# Altium project Stethoscope.PrjPcb
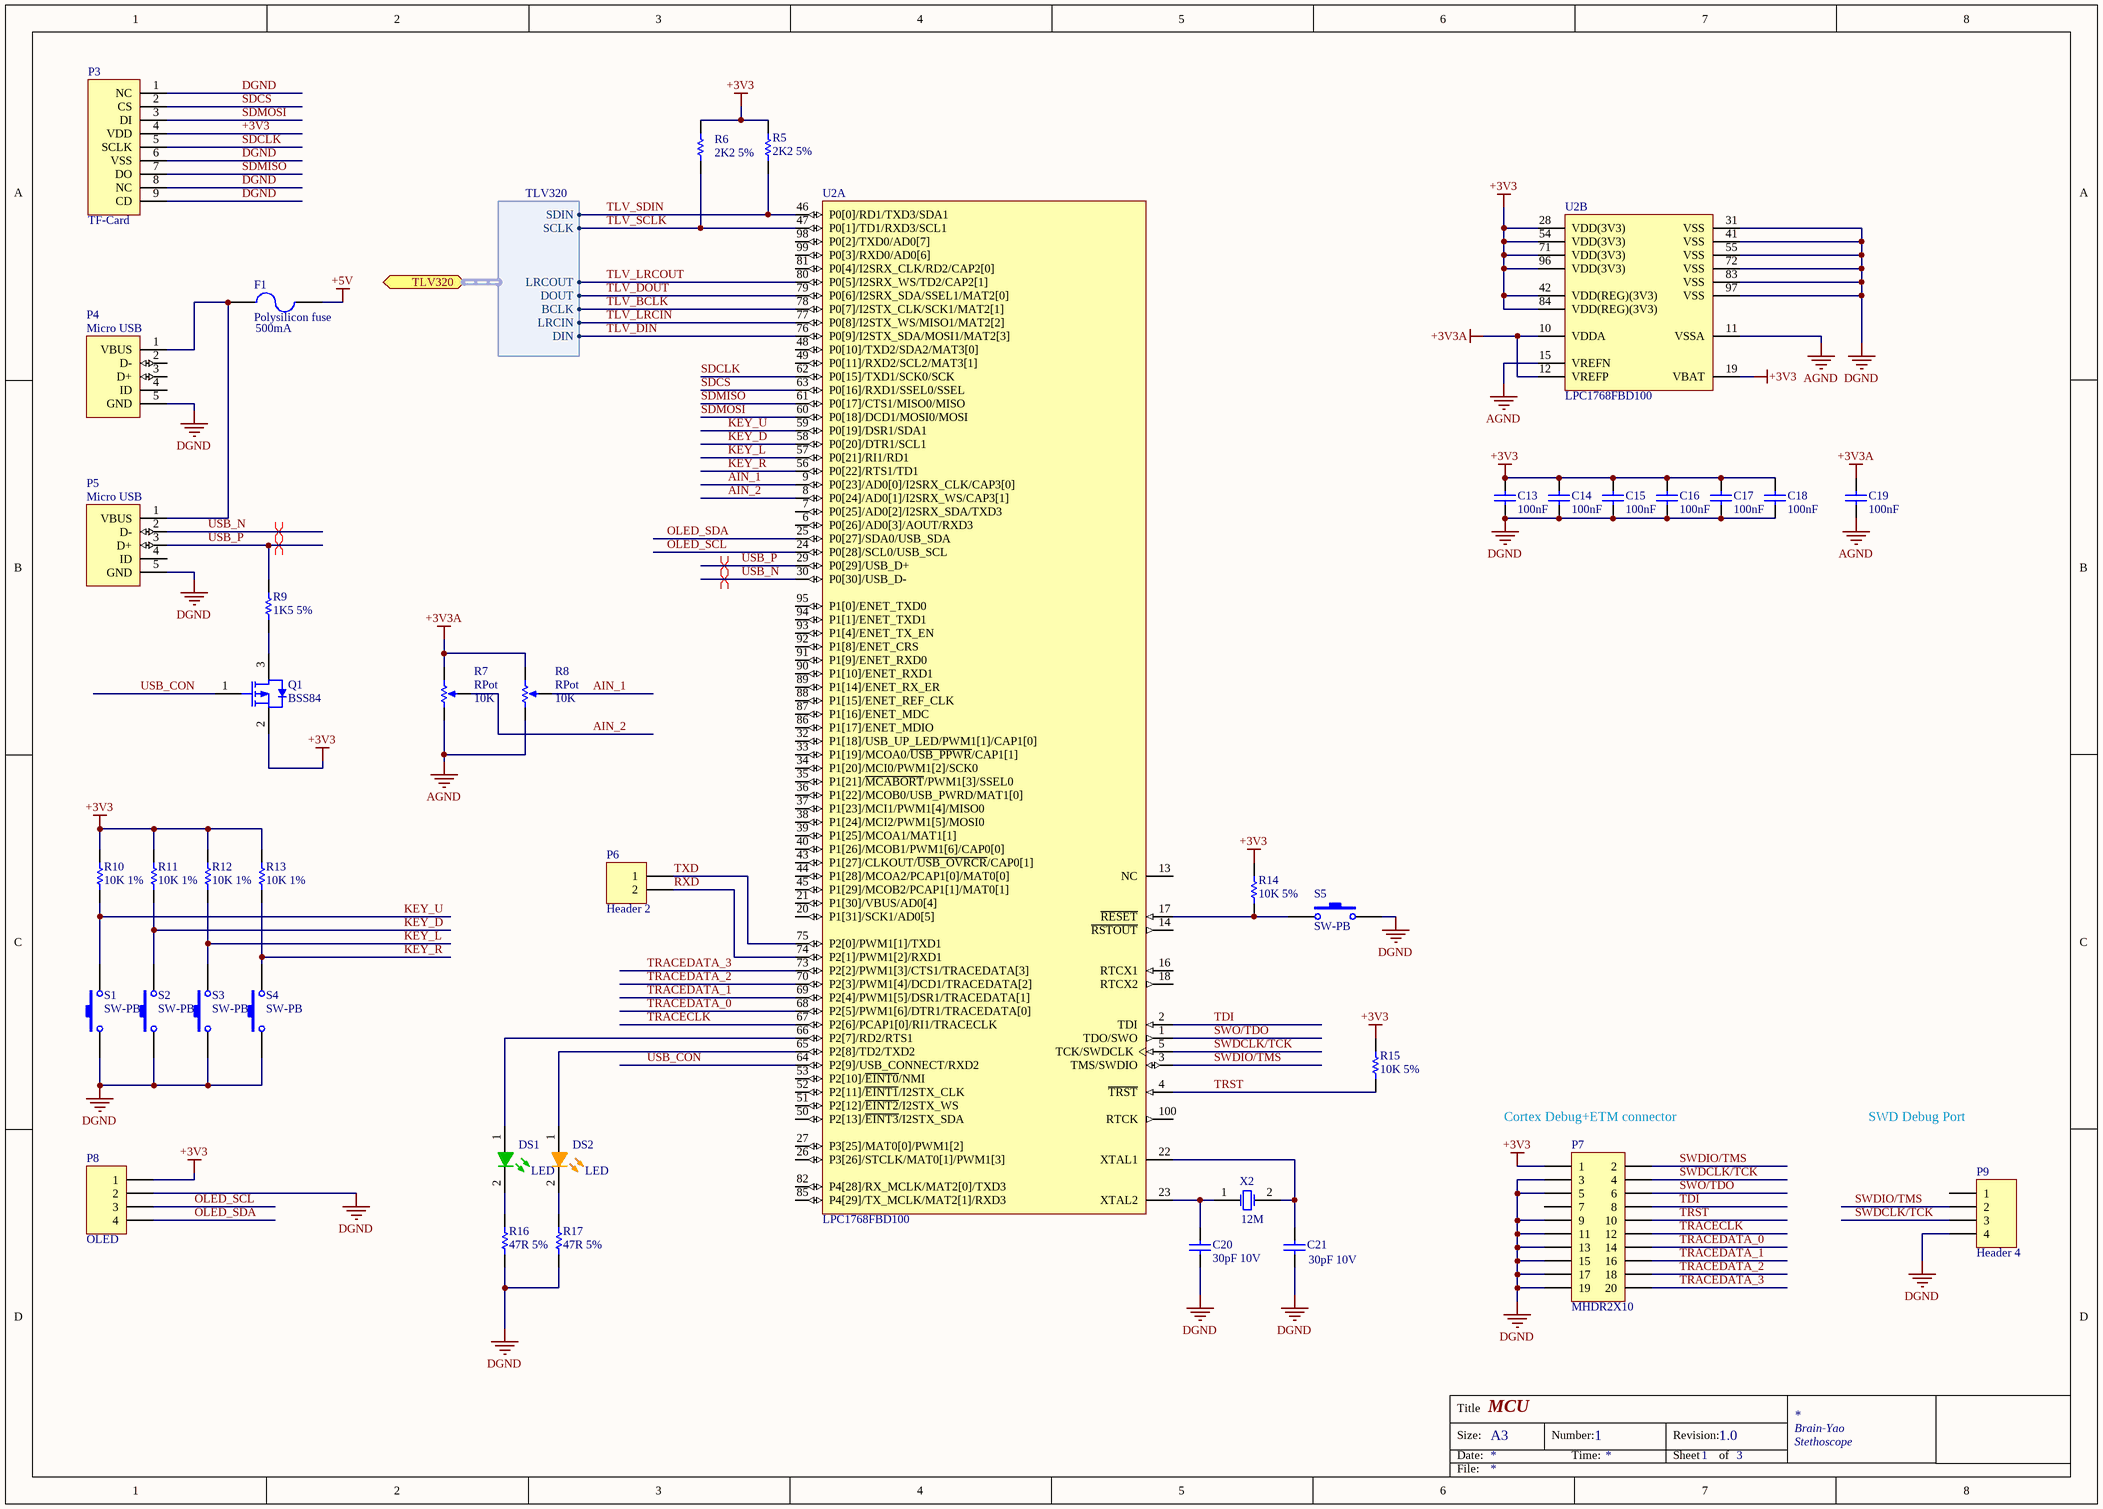
[diagram p0: MCU.SchDoc]
3 sheets, 75 parts. Net scope: flat (ports and power ports of the same name join across sheets).
Board file: Stethoscope.PcbDoc
Sheets:
  MCU.SchDoc
  Codec.SchDoc
  Power.SchDoc

## Sheet MCU.SchDoc: MCU
size A3; DrawnBy: Brain-Yao; DocumentNumber: 1; Revision: 1.0; SheetNumber: 1; SheetTotal: 3; ProjectName: Stethoscope

### Parts
(Parts that share a designator on the sheet are numbered #1, #2 ... from top to bottom, then left to right.)
C13  100nF  [CAPC0603(1608)100_M]
C14  100nF  [CAPC0603(1608)100_M]
C15  100nF  [CAPC0603(1608)100_M]
C16  100nF  [CAPC0603(1608)100_M]
C17  100nF  [CAPC0603(1608)100_M]
C18  100nF  [CAPC0603(1608)100_M]
C19  100nF  [CAPC0603(1608)100_M]
C20  30pF 10V  [CAPC0603(1608)100_M]
C21  30pF 10V  [CAPC0603(1608)100_M]
DS1  LED  [KING-0603LED_GREEN_V]
DS2  LED  [KING-0603LED_ORANGE_V]
F1  Polysilicon fuse  value 500mA  [RESC2012N]
P3  TF-Card  [Micro_TF_01A]
P4  Micro USB  [HIRO-ZX62D-AB-5P8_V]
P5  Micro USB  [HIRO-ZX62D-AB-5P8_V]
P6  Header 2  [HDR1X2]
P7  MHDR2X10  [MHDR2X10]
P8  OLED  [OLED]
P9  Header 4  [HDR1X4]
Q1  BSS84  [NXP-SOT23_N]
R5  2K2 5%  [RESC0603(1608)_M]
R6  2K2 5%  [RESC0603(1608)_M]
R7  RPot  value 10K  [R09]
R8  RPot  value 10K  [R09]
R9  1K5 5%  [RESC0603(1608)_M]
R10  10K 1%  [RESC0603(1608)_M]
R11  10K 1%  [RESC0603(1608)_M]
R12  10K 1%  [RESC0603(1608)_M]
R13  10K 1%  [RESC0603(1608)_M]
R14  10K 5%  [RESC0603(1608)_M]
R15  10K 5%  [RESC0603(1608)_M]
R16  47R 5%  [RESC0603(1608)_M]
R17  47R 5%  [RESC0603(1608)_M]
S1  SW-PB  [4x4_switch]
S2  SW-PB  [4x4_switch]
S3  SW-PB  [4x4_switch]
S4  SW-PB  [4x4_switch]
S5  SW-PB  [4x4_switch]
U2#1  LPC1768FBD100  [SOT407-1_L]  (part A of 2)
U2#2  LPC1768FBD100  [SOT407-1_L]  (part B of 2)
X2  12M  [49S]

### Ports
TLV320 (harness TLV320)

### Harnesses
TLV320: SDIN, SCLK, LRCOUT, DOUT, BCLK, DIN, LRCIN

### Nets
+3V3: C13.2 C14.2 C15.2 C16.2 C17.2 C18.2 P3.4(VDD) P7.1 P8.1 Q1.2(S) R5.2 R6.2 R10.2 R11.2 R12.2 R13.2 R14.2 R15.2 U2#2.19(VBAT) U2#2.28(VDD(3V3)) U2#2.42(VDD(REG)(3V3)) U2#2.54(VDD(3V3)) U2#2.71(VDD(3V3)) U2#2.84(VDD(REG)(3V3)) U2#2.96(VDD(3V3))
+3V3A: C19.2 R7.2(BOT) R8.2(BOT) U2#2.10(VDDA) U2#2.12(VREFP)
+5V: F1.2
AGND: C19.1 R7.1(TOP) R8.1(TOP) U2#2.11(VSSA) U2#2.15(VREFN)
DGND: C13.1 C14.1 C15.1 C16.1 C17.1 C18.1 C20.1 C21.1 P3.1(NC) P3.6(VSS) P3.8(NC) P3.9(CD) P4.5(GND) P5.5(GND) P7.3 P7.5 P7.9 P7.11 P7.13 P7.15 P7.17 P7.19 P8.2 P9.4 R16.1 R17.1 S1.1 S2.1 S3.1 S4.1 S5.2 U2#2.31(VSS) U2#2.41(VSS) U2#2.55(VSS) U2#2.72(VSS) U2#2.83(VSS) U2#2.97(VSS)
AIN_1: R8.3(TAP) U2#1.9(P0[23]/AD0[0]/I2SRX_CLK/CAP3[0])
AIN_2: R7.3(TAP) U2#1.8(P0[24]/AD0[1]/I2SRX_WS/CAP3[1])
KEY_D: R11.1 S2.2 U2#1.58(P0[20]/DTR1/SCL1)
KEY_L: R12.1 S3.2 U2#1.57(P0[21]/RI1/RD1)
KEY_R: R13.1 S4.2 U2#1.56(P0[22]/RTS1/TD1)
KEY_U: R10.1 S1.2 U2#1.59(P0[19]/DSR1/SDA1)
OLED_SCL: P8.3 U2#1.24(P0[28]/SCL0/USB_SCL)
OLED_SDA: P8.4 U2#1.25(P0[27]/SDA0/USB_SDA)
RXD: P6.2 U2#1.74(P2[1]/PWM1[2]/RXD1)
SDCLK: P3.5(SCLK) U2#1.62(P0[15]/TXD1/SCK0/SCK)
SDCS: P3.2(CS) U2#1.63(P0[16]/RXD1/SSEL0/SSEL)
SDMISO: P3.7(DO) U2#1.61(P0[17]/CTS1/MISO0/MISO)
SDMOSI: P3.3(DI) U2#1.60(P0[18]/DCD1/MOSI0/MOSI)
SWDCLK/TCK: P7.4 P9.3 U2#1.5(TCK/SWDCLK)
SWDIO/TMS: P7.2 P9.2 U2#1.3(TMS/SWDIO)
SWO/TDO: P7.6 U2#1.1(TDO/SWO)
TDI: P7.8 U2#1.2(TDI)
TLV_BCLK: U2#1.78(P0[7]/I2STX_CLK/SCK1/MAT2[1]) ; port TLV320.BCLK
TLV_DIN: U2#1.76(P0[9]/I2STX_SDA/MOSI1/MAT2[3]) ; port TLV320.DIN
TLV_DOUT: U2#1.79(P0[6]/I2SRX_SDA/SSEL1/MAT2[0]) ; port TLV320.DOUT
TLV_LRCIN: U2#1.77(P0[8]/I2STX_WS/MISO1/MAT2[2]) ; port TLV320.LRCIN
TLV_LRCOUT: U2#1.80(P0[5]/I2SRX_WS/TD2/CAP2[1]) ; port TLV320.LRCOUT
TLV_SCLK: R6.1 U2#1.47(P0[1]/TD1/RXD3/SCL1) ; port TLV320.SCLK
TLV_SDIN: R5.1 U2#1.46(P0[0]/RD1/TXD3/SDA1) ; port TLV320.SDIN
TRACECLK: P7.12 U2#1.67(P2[6]/PCAP1[0]/RI1/TRACECLK)
TRACEDATA_0: P7.14 U2#1.68(P2[5]/PWM1[6]/DTR1/TRACEDATA[0])
TRACEDATA_1: P7.16 U2#1.69(P2[4]/PWM1[5]/DSR1/TRACEDATA[1])
TRACEDATA_2: P7.18 U2#1.70(P2[3]/PWM1[4]/DCD1/TRACEDATA[2])
TRACEDATA_3: P7.20 U2#1.73(P2[2]/PWM1[3]/CTS1/TRACEDATA[3])
TRST: P7.10 R15.1 U2#1.4(~{TRST})
TXD: P6.1 U2#1.75(P2[0]/PWM1[1]/TXD1)
USB_CON: Q1.1(G) U2#1.64(P2[9]/USB_CONNECT/RXD2)
USB_N: P5.2(D-) U2#1.30(P0[30]/USB_D-)
USB_P: P5.3(D+) R9.2 U2#1.29(P0[29]/USB_D+)
NetC20_2: C20.2 U2#1.23(XTAL2) X2.1(OSC1)
NetC21_2: C21.2 U2#1.22(XTAL1) X2.2(OSC2)
NetDS1_1: DS1.1(A) U2#1.66(P2[7]/RD2/RTS1)
NetDS1_2: DS1.2(K) R16.2
NetDS2_1: DS2.1(A) U2#1.65(P2[8]/TD2/TXD2)
NetDS2_2: DS2.2(K) R17.2
NetF1_1: F1.1 P4.1(VBUS) P5.1(VBUS)
NetQ1_3: Q1.3(D) R9.1
NetR14_1: R14.1 S5.1 U2#1.17(~{RESET})

Not connected (* = marked no-connect by the designer): P4 2(D-) 3(D+) 4(ID) 6(SHLD) 7(SHLD) 8(SHLD) 9(SHLD) 10(SHLD) 11(SHLD); P5 4(ID) 6(SHLD) 7(SHLD) 8(SHLD) 9(SHLD) 10(SHLD) 11(SHLD); P7 7; P9 1; U2#1 6(P0[26]/AD0[3]/AOUT/RXD3) 7(P0[25]/AD0[2]/I2SRX_SDA/TXD3) 13(NC) 14(~{RSTOUT}) 16(RTCX1) 18(RTCX2) 20(P1[31]/SCK1/AD0[5]) 21(P1[30]/VBUS/AD0[4]) 26(P3[26]/STCLK/MAT0[1]/PWM1[3]) 27(P3[25]/MAT0[0]/PWM1[2]) 32(P1[18]/USB_UP_LED/PWM1[1]/CAP1[0]) 33(P1[19]/MCOA0/~{USB_PPWR}/CAP1[1]) 34(P1[20]/MCI0/PWM1[2]/SCK0) 35(P1[21]/~{MCABORT}/PWM1[3]/SSEL0) 36(P1[22]/MCOB0/USB_PWRD/MAT1[0]) 37(P1[23]/MCI1/PWM1[4]/MISO0) 38(P1[24]/MCI2/PWM1[5]/MOSI0) 39(P1[25]/MCOA1/MAT1[1]) 40(P1[26]/MCOB1/PWM1[6]/CAP0[0]) 43(P1[27]/CLKOUT/~{USB_OVRCR}/CAP0[1]) 44(P1[28]/MCOA2/PCAP1[0]/MAT0[0]) 45(P1[29]/MCOB2/PCAP1[1]/MAT0[1]) 48(P0[10]/TXD2/SDA2/MAT3[0]) 49(P0[11]/RXD2/SCL2/MAT3[1]) 50(P2[13]/~{EINT3}/I2STX_SDA) 51(P2[12]/~{EINT2}/I2STX_WS) 52(P2[11]/~{EINT1}/I2STX_CLK) 53(P2[10]/~{EINT0}/NMI) 81(P0[4]/I2SRX_CLK/RD2/CAP2[0]) 82(P4[28]/RX_MCLK/MAT2[0]/TXD3) 85(P4[29]/TX_MCLK/MAT2[1]/RXD3) 86(P1[17]/ENET_MDIO) 87(P1[16]/ENET_MDC) 88(P1[15]/ENET_REF_CLK) 89(P1[14]/ENET_RX_ER) 90(P1[10]/ENET_RXD1) 91(P1[9]/ENET_RXD0) 92(P1[8]/ENET_CRS) 93(P1[4]/ENET_TX_EN) 94(P1[1]/ENET_TXD1) 95(P1[0]/ENET_TXD0) 98(P0[2]/TXD0/AD0[7]) 99(P0[3]/RXD0/AD0[6]) 100(RTCK)

### Layout directives
differential pair: USB_N, USB_P

### Notes on the sheet
- (near P7) Cortex Debug+ETM connector
- SWD Debug Port
- Title
- Size:
- Date:
- A3
- Number:
- Time:
- Revision:
- Sheet
- of
- File:

### Library data of the parts
C13-C19 = CMP-1035-02584-1: CAP 100nF 16V ±10% 0603 (1608 Metric) Thickness 1mm SMD; Case-EIA: 0603; Case-Metric: 1608; Tolerance: ±10%; Technology: SMT; Max Thickness: 1 mm; Value: 100nF; Rated Voltage: 16 V
C20 C21 = CMP-1035-00901-1: CAP 30pF 10V ±2% 0603 (1608 Metric) Thickness 1mm SMD; Case-EIA: 0603; Case-Metric: 1608; Value: 30pF; Technology: SMT; Max Thickness: 1 mm; Tolerance: ±2%; Rated Voltage: 10 V
DS1 = CMP-0404-00001-1: LED, SMT, 0603(1608), 1.1mm thickness, Green; Manufacturer: Kingbright; PartNumber: KP-1608MGC; Reverse Voltage: 5 V; Power Dissipation: 75 mW; Forward Current: 30 mA; Packing Type: 2000 pcs / reel; Mounting Technology: Surface Mount; Storage Temperature: -40 to +85 degC; ComponentLink1URL: http://www.kingbright.com/; PackageDescription: 2-Pin SMT LED, 1.6 x 0.8 mm Pitch; PackageReference: 0603LED_GREEN; ComponentLink1Description: Manufacturer URL
DS2 = CMP-0404-00002-1: LED, SMT, 0603(1608), 1.1mm thickness, Orange; PartNumber: KP-1608SECK; Manufacturer: Kingbright; Power Dissipation: 75 mW; Packing Type: 2000 pcs / reel; Reverse Voltage: 5 V; Forward Current: 30 mA; Storage Temperature: -40 to +85 degC; ComponentLink2Description: Datasheet; ComponentLink1URL: http://www.kingbright.com/; Mounting Technology: Surface Mount; ComponentLink2URL: http://www.kingbright.com/manager/upload/pdf/(1366274642)KP-1608SECK(Ver.14A).pdf; PackageDescription: 2-Pin SMT LED, 1.6 x 0.8 mm Pitch; ComponentLink1Description: Manufacturer URL; PackageReference: 0603LED_ORANGE
F1 = Fuse 2: Polysilicon fuse 50mA; Published: 8-Jun-2000; LatestRevisionDate: 17-Jul-2002; LatestRevisionNote: Re-released for DXP Platform.; PackageReference: PIN-W2/E2.8; Publisher: Altium Limited; PackageDescription: Thru-Hole; 2 Leads
P4 P5 = CMP-1349-00001-1: USB 2.0 Standard Micro-USB Connector, Micro AB-Standard (Bottom Mount), 30 V AC, -30 to 85 degC, Right Angle, 5-Pin 7.5 x 5.6 x 2.8 mm SMD, RoHS, Reel; PartNumber: ZX62D-AB-5P8; Manufacturer: Hirose Electric; Contact Resistance: 30 mOhm Max.; Number of Contacts: 5; Capacitance: 2 pF Max.; Voltage Rating: 30 V AC; Mounting Technology: Surface Mount; ComponentLink2Description: Datasheet; DatasheetVersion: Aug-14; RoHS: TRUE; ComponentLink2URL: http://www.hirose.co.jp/cataloge_hp/ed_ZX_20140804.pdf; Packing: Reel; Operating Temperature Range: -30 to 85 degC; PackageDescription: USB Micro-AB Connector, Right Angle, Body 7.5 x 5.6 mm, Pitch 0.65 mm, Height 2.8 mm; ComponentLink1URL: http://www.hirose.com/; ComponentLink1Description: Manufacturer URL; ComponentLink3URL: http://www.hirose.co.jp/cataloge_hp/ed_ZX_20140804.pdf; ComponentLink3Description: Package Specification
P6 = Header 2: Header, 2-Pin; LatestRevisionDate: 17-Jul-2002; LatestRevisionNote: Re-released for DXP Platform.; Publisher: Altium Limited
P7 = MHDR2X10: Header, 10-Pin, Dual row; LatestRevisionDate: 17-Jul-2002; LatestRevisionNote: Re-released for DXP Platform.; Publisher: Altium Limited
P8 P9 = Header 4: Header, 4-Pin; LatestRevisionDate: 17-Jul-2002; LatestRevisionNote: Re-released for DXP Platform.; Publisher: Altium Limited
Q1 = CMP-1258-00128-1: P-Channel Enhancement Mode Vertical DMOS Transistor, -50 V, -0.13 A, 3-Pin SOT23, Tape and Reel; PartNumber: BSS84,215; Manufacturer: NXP Semiconductors; Ciss [typ] (pF): 25; Packing: Tape & Reel; Channel Type: P; Coss [typ] (pF): 15; PackageVersion: 06-03-16, 03/2006; ComponentLink1URL: http://www.nxp.com/; ComponentLink3Description: Package Specification; PackageReference: SOT23; PackageDescription: 3-Pin Small Outline Transistor Package, Body 2.9 x 1.3 mm, Pitch 0.95 mm; Code_JEDEC: TO-236AB; ComponentLink2Description: Datasheet; VDS [max] (V): -50; ComponentLink3URL: http://www.nxp.com/documents/outline_drawing/sot023_po.pdf; ComponentLink1Description: Manufacturer URL; Mounting Technology: Surface Mount; ComponentLink2URL: http://www.nxp.com/documents/data_sheet/BSS84.pdf; ID [max] (A): -0.13; DatasheetVersion: Rev. 06
R5 R6 = CMP-1012-00082-1: 2K2 0.1W 5% 0603 (1608 Metric)  SMD; Case-Metric: 1608; Value: 2200.00 Ohm; Case-EIA: 0603; Power: 0.1 W; Tolerance: 5 %; Technology: SMT
R7 R8 = RPot: Potentiometer; Sim Note: Enter the Resistance value and the set point into parameter fields.; Set Position: 0.5; Published: 8-Jun-2000; LatestRevisionDate: 17-Jul-2002; LatestRevisionNote: Re-released for DXP Platform.; PackageReference: VR5; Publisher: Altium Limited; PackageDescription: Variable Resistor, Thru-Hole; 3 Leads
R9 = CMP-1012-00078-1: 1K5 0.1W 5% 0603 (1608 Metric)  SMD; Case-Metric: 1608; Case-EIA: 0603; Value: 1500.00 Ohm; Technology: SMT; Power: 0.1 W; Tolerance: 5 %
R10-R13 = CMP-1012-00623-1: 10K 0.1W 1% 0603 (1608 Metric)  SMD; Value: 10000.00 Ohm; Case-EIA: 0603; Case-Metric: 1608; Power: 0.1 W; Tolerance: 1 %; Technology: SMT
R14 R15 = CMP-1012-00098-1: 10K 0.1W 5% 0603 (1608 Metric)  SMD; Case-EIA: 0603; Value: 10000.00 Ohm; Case-Metric: 1608; Technology: SMT; Tolerance: 5 %; Power: 0.1 W
R16 R17 = CMP-1012-00042-1: 47R 0.1W 5% 0603 (1608 Metric)  SMD; Value: 47.00 Ohm; Case-Metric: 1608; Case-EIA: 0603; Tolerance: 5 %; Technology: SMT; Power: 0.1 W
S1-S5 = SW-PB: Switch; Published: 24-Mar-1999; LatestRevisionDate: 17-Jul-2002; LatestRevisionNote: Re-released for DXP Platform.; PackageReference: SPST-2; Publisher: Altium Limited; PackageDescription: Switch; 2 Leads
U2#1 U2#2 = CMP-0174-00010-4: Cortex-M3, 32-Bit ARM MCU, 512 kB flash, 64 kB SRAM, Ethernet, USB 2.0 Device/Host/OTG, 12-Bit ADC, DAC, I2S, 100-Pin LQFP; USB: 1; CAN: 2; PLL: Y; ADC channels: 8; fmax: 100 MHz; Timers: 4; PWM: 6; VDD (min): 2.4 V; SRAM: 64 kB; Code_IEC: 136E20; Flash: 512 kB; VDD (typ): 3.3 V; GPIOs: 70; VDD (max): 3.6 V; Code_JEDEC: MS-026; DatasheetVersion: Rev. 8, Nov-2011; ComponentLink2Description: Datasheet; ComponentLink1Description: Manufacturer URL; PartNumber: LPC1768FBD100; PackageVersion: 37672; UART: 4; PackageDescription: LQFP100: Plastic Low Profile Quad Flat Package; 100 Leads; Body 14 x 14 x 1.4 mm; SPI: 1; SSP: 2; ComponentLink2URL: http://www.nxp.com/documents/data_sheet/LPC1769_68_67_66_65_64_63.pdf; ComponentLink1URL: http://www.nxp.com/; PackageReference: SOT407-1; PartId: 1
X2 = XTAL: Crystal Oscillator; Published: 8-Jun-2000; LatestRevisionDate: 17-Jul-2002; LatestRevisionNote: Re-released for DXP Platform.; PackageReference: R38; Publisher: Altium Limited; PackageDescription: Crystal, Thru-Hole; 2 Leads; Body 3.1 x 8.2 mm (Dia.xH)

## Sheet Codec.SchDoc: Codec
size A4; DrawnBy: Brain-Yao; DocumentNumber: 2; Revision: 1.0; SheetNumber: 2; SheetTotal: 3; ProjectName: Stethoscope
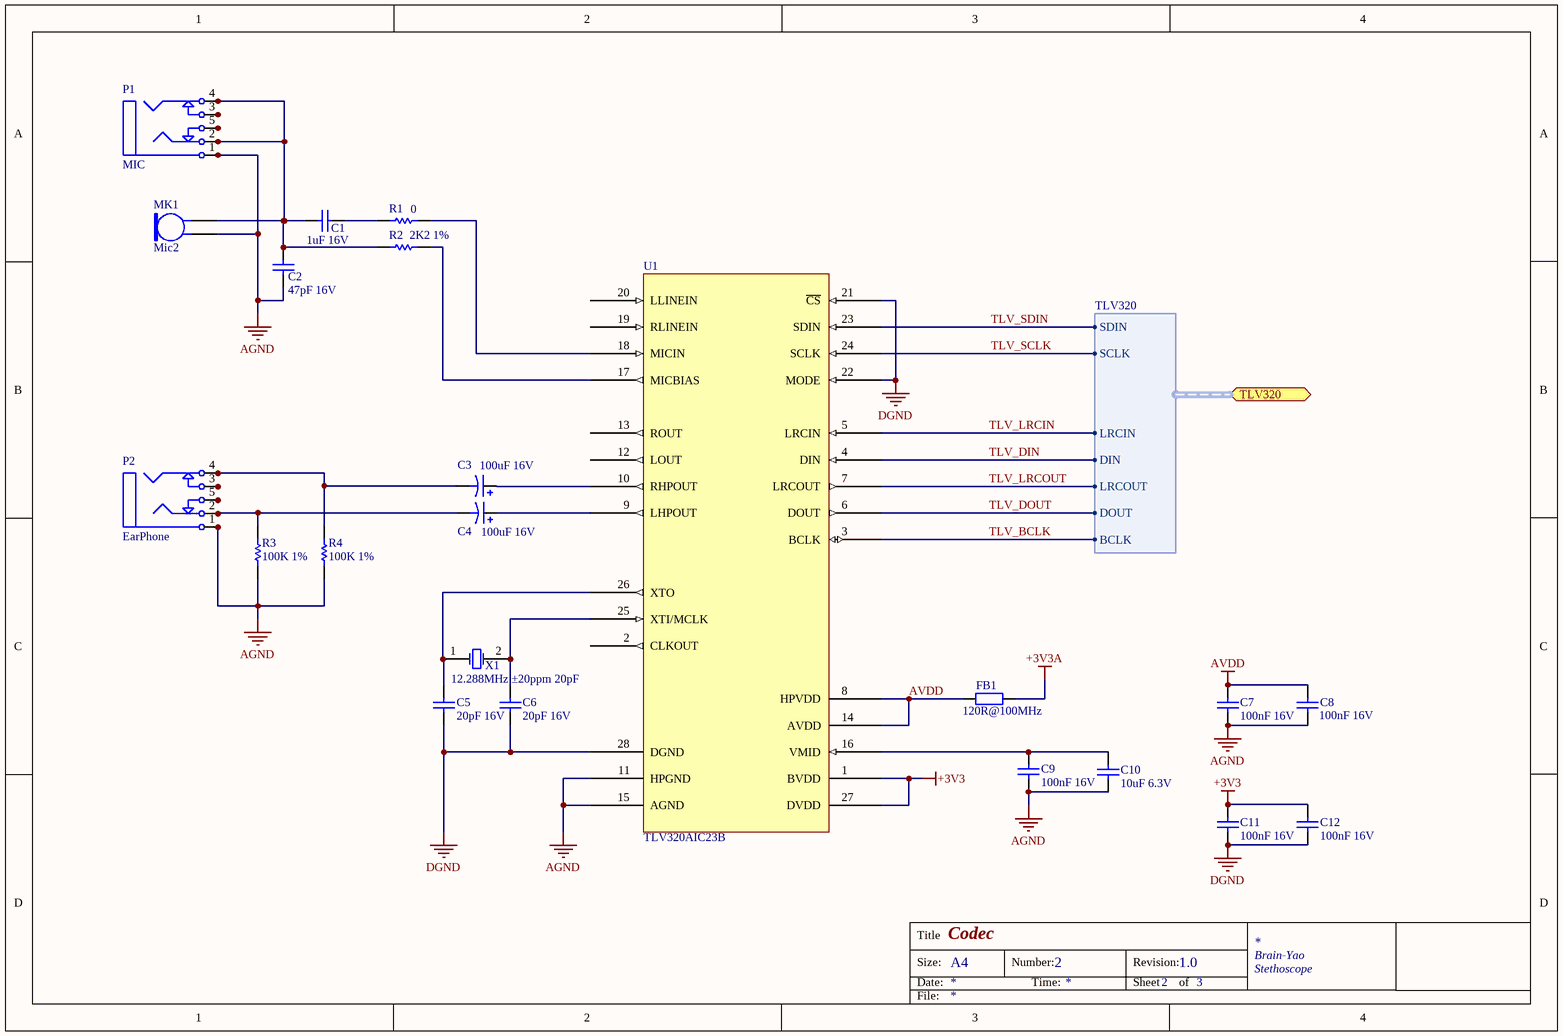
[diagram p1: Codec.SchDoc]

### Parts
C1  1uF 16V  [CAPC0603(1608)100_M]
C2  47pF 16V  [CAPC0603(1608)100_M]
C3  100uF 16V  [HONOR_63X54]
C4  100uF 16V  [HONOR_63X54]
C5  20pF 16V  [CAPC0603(1608)100_M]
C6  20pF 16V  [CAPC0603(1608)100_M]
C7  100nF 16V  [CAPC0603(1608)100_M]
C8  100nF 16V  [CAPC0603(1608)100_M]
C9  100nF 16V  [CAPC0603(1608)100_M]
C10  10uF 6.3V  [CAPC0603(1608)100_M]
C11  100nF 16V  [CAPC0603(1608)100_M]
C12  100nF 16V  [CAPC0603(1608)100_M]
FB1  120R@100MHz  [RESC1608N]
MK1  Mic2  [PIN2]
P1  MIC  [ST-3150-5N]
P2  EarPhone  [ST-3150-5N]
R1  0  [RESC0603(1608)_M]
R2  2K2 1%  [RESC0603(1608)_M]
R3  100K 1%  [RESC0603(1608)_M]
R4  100K 1%  [RESC0603(1608)_M]
U1  TLV320AIC23B  [PW28]
X1  12.288MHz ±20ppm 20pF  [49S]

### Ports
TLV320 (harness TLV320)

### Harnesses
TLV320: SDIN, SCLK, LRCOUT, DOUT, BCLK, DIN, LRCIN

### Nets
+3V3: C11.2 C12.2 U1.1(BVDD) U1.27(DVDD)
+3V3A: FB1.2
AGND: C2.1 C7.1 C8.1 C9.1 C10.1 MK1.2 P1.1 P1.1A P1.1B P2.1 P2.1A P2.1B R3.1 R4.1 U1.11(HPGND) U1.15(AGND)
AVDD: C7.2 C8.2 FB1.1 U1.8(HPVDD) U1.14(AVDD)
DGND: C5.1 C6.1 C11.1 C12.1 U1.21(~{CS}) U1.22(MODE) U1.28(DGND)
TLV_BCLK: U1.3(BCLK) ; port TLV320.BCLK
TLV_DIN: U1.4(DIN) ; port TLV320.DIN
TLV_DOUT: U1.6(DOUT) ; port TLV320.DOUT
TLV_LRCIN: U1.5(LRCIN) ; port TLV320.LRCIN
TLV_LRCOUT: U1.7(LRCOUT) ; port TLV320.LRCOUT
TLV_SCLK: U1.24(SCLK) ; port TLV320.SCLK
TLV_SDIN: U1.23(SDIN) ; port TLV320.SDIN
NetC1_1: C1.1 C2.2 MK1.1 P1.2 P1.2A P1.2B P1.4 P1.4A P1.4B R2.1
NetC1_2: C1.2 R1.1
NetC3_1: C3.1 U1.10(RHPOUT)
NetC3_2: C3.2 P2.4 P2.4A P2.4B R4.2
NetC4_1: C4.1 U1.9(LHPOUT)
NetC4_2: C4.2 P2.2 P2.2A P2.2B R3.2
NetC5_2: C5.2 U1.26(XTO) X1.1(OSC1)
NetC6_2: C6.2 U1.25(XTI/MCLK) X1.2(OSC2)
NetC9_2: C9.2 C10.2 U1.16(VMID)
NetP1_3: P1.3 P1.3A P1.3B
NetP1_5: P1.5 P1.5A P1.5B
NetP2_3: P2.3 P2.3A P2.3B
NetP2_5: P2.5 P2.5A P2.5B
NetR1_2: R1.2 U1.18(MICIN)
NetR2_2: R2.2 U1.17(MICBIAS)

Not connected (* = marked no-connect by the designer): U1 2(CLKOUT) 12(LOUT) 13(ROUT) 19(RLINEIN) 20(LLINEIN)

### Notes on the sheet
- Title
- Size:
- Date:
- A4
- Number:
- Time:
- Revision:
- Sheet
- of
- File:

### Library data of the parts
C1 = CMP-1035-02736-1: CAP 1uF 16V ±5% 0603 (1608 Metric) Thickness 1mm SMD; Case-Metric: 1608; Case-EIA: 0603; Technology: SMT; Max Thickness: 1 mm; Rated Voltage: 16 V; Value: 1uF; Tolerance: ±5%
C2 = CMP-1035-01051-1: CAP 47pF 16V ±5% 0603 (1608 Metric) Thickness 1mm SMD; Case-Metric: 1608; Case-EIA: 0603; Max Thickness: 1 mm; Value: 47pF; Technology: SMT; Tolerance: ±5%; Rated Voltage: 16 V
C3 C4 = Cap Pol1: Polarized Capacitor (Radial); Published: 8-Jun-2000; LatestRevisionDate: 17-Jul-2002; LatestRevisionNote: Re-released for DXP Platform.; PackageReference: RB7.6-15; Publisher: Altium Limited; PackageDescription: Polarized Capacitor (Radial); 2 Leads; Value: 100uF
C5 C6 = CMP-1035-00768-1: CAP 20pF 16V ±0.25pF 0603 (1608 Metric) Thickness 1mm SMD; Case-Metric: 1608; Case-EIA: 0603; Max Thickness: 1 mm; Value: 20pF; Technology: SMT; Rated Voltage: 16 V; Tolerance: ±0.25pF
C7-C9 C11 C12 = CMP-1035-02584-1: as C13 on sheet MCU; Tolerance: ±10%; Technology: SMT; Max Thickness: 1 mm; Value: 100nF; Rated Voltage: 16 V
C10 = CMP-1035-02796-1: CAP 10uF 6.3V ±10% 0603 (1608 Metric) Thickness 1mm SMD; Case-EIA: 0603; Case-Metric: 1608; Tolerance: ±10%; Value: 10uF; Technology: SMT; Rated Voltage: 6.3 V; Max Thickness: 1 mm
FB1 = Res2: Resistor; Published: 8-Jun-2000; LatestRevisionDate: 17-Jul-2002; LatestRevisionNote: Re-released for DXP Platform.; PackageReference: AXIAL-0.4; Publisher: Altium Limited; PackageDescription: Axial Device, Thru-Hole; 2 Leads; 0.4 in Pin Spacing; Value: 120R@100MHz
MK1 = Mic2: Microphone; Published: 24-Mar-1999; LatestRevisionDate: 17-Jul-2002; LatestRevisionNote: Re-released for DXP Platform.; PackageReference: PIN2; Publisher: Altium Limited
P1 P2 = Phonejack Stereo SW: 3-Conductor Jack with 2 break contacts (normals) and 2 auxiliary make contacts; Published: 5-Jan-2004; LatestRevisionDate: 17-Dec-2003; LatestRevisionNote: PCB Footprint replaced.; DatasheetDocument: 07-Mar-2000; Publisher: Altium Limited; ComponentLink1Description: Manufacturer Link; ComponentLink1URL: http://domino.kycon.com/internet/Products.html
R1 = CMP-1012-00001-1: Jumper 0603 (1608 Metric); Case-Metric: 1608; Value: 0.00 Ohm; Power: None; Case-EIA: 0603; Technology: SMT; Tolerance: None
R2 = CMP-1012-00546-1: 2K2 0.1W 1% 0603 (1608 Metric)  SMD; Case-EIA: 0603; Value: 2200.00 Ohm; Case-Metric: 1608; Tolerance: 1 %; Power: 0.1 W; Technology: SMT
R3 R4 = CMP-1012-00736-1: 100K 0.1W 1% 0603 (1608 Metric)  SMD; Value: 100000.00 Ohm; Case-Metric: 1608; Case-EIA: 0603; Power: 0.1 W; Tolerance: 1 %; Technology: SMT
U1 = TLV320AIC23B: Imported; Manufacturer_Part_Number: tlv320aic23b_pw_28; Vendor: Texas Instruments; PACKAGE_DESIGNATOR: PW; PIN_COUNT: 28; FAMILY_NAME: Audio CODEC; INDUSTRY_STD_PKG_TYPE: TSSOP; GENERIC_PART_NUMBER: TLV320AIC23B; Datasheet URL: http://www.ti.com/lit/gpn/TLV320AIC23B; Manufacturer: Texas Instruments; RefDes: RefDes; Type: DEV; Value: Value
X1 = XTAL: Crystal Oscillator; Published: 8-Jun-2000; LatestRevisionDate: 17-Jul-2002; LatestRevisionNote: Re-released for DXP Platform.; PackageReference: R38; Publisher: Altium Limited; PackageDescription: Crystal, Thru-Hole; 2 Leads; Body 3.1 x 8.2 mm (Dia.xH)

## Sheet Power.SchDoc: Power
size A4; DrawnBy: Brain-Yao; DocumentNumber: 3; Revision: 1.0; SheetNumber: 3; SheetTotal: 3; ProjectName: Stethoscope
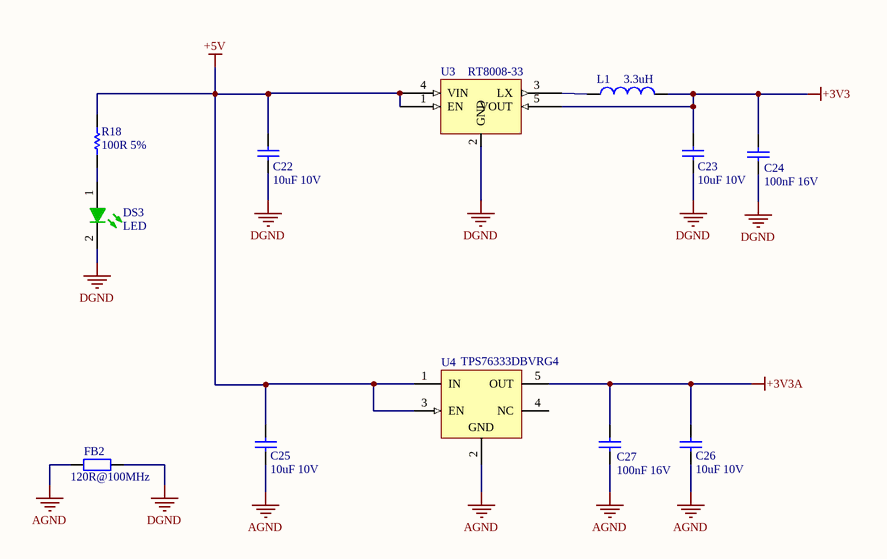
[diagram p2: Power.SchDoc]

### Parts
C22  10uF 10V  [CAPC0603(1608)100_M]
C23  10uF 10V  [CAPC0603(1608)100_M]
C24  100nF 16V  [CAPC0603(1608)100_M]
C25  10uF 10V  [CAPC0603(1608)100_M]
C26  10uF 10V  [CAPC0603(1608)100_M]
C27  100nF 16V  [CAPC0603(1608)100_M]
DS3  LED  [KING-0603LED_GREEN_V]
FB2  120R@100MHz  [RESC1608N]
L1  3.3uH  [INDC2012N]
R18  100R 5%  [RESC0603(1608)_M]
U3  RT8008-33  [SOT23-5AN]
U4  TPS76333DBVRG4  [TI-DBV5_N]

### Nets
+3V3: C23.2 C24.2 L1.2 U3.5(VOUT)
+3V3A: C26.2 C27.2 U4.5(OUT)
+5V: C22.2 C25.2 R18.2 U3.1(EN) U3.4(VIN) U4.1(IN) U4.3(EN)
AGND: C25.1 C26.1 C27.1 FB2.1 U4.2(GND)
DGND: C22.1 C23.1 C24.1 DS3.2(K) FB2.2 U3.2(GND)
NetDS3_1: DS3.1(A) R18.1
NetL1_1: L1.1 U3.3(LX)

Not connected (* = marked no-connect by the designer): U4 4(NC)

### Notes on the sheet
- Title
- Size:
- Date:
- A4
- Number:
- Time:
- Revision:
- Sheet
- of
- File:

### Library data of the parts
C22 C23 C25 C26 = CMP-1035-02799-1: CAP 10uF 10V ±10% 0603 (1608 Metric) Thickness 1mm SMD; Case-Metric: 1608; Case-EIA: 0603; Max Thickness: 1 mm; Tolerance: ±10%; Technology: SMT; Rated Voltage: 10 V; Value: 10uF
C24 C27 = CMP-1035-02584-1: as C13 on sheet MCU; Tolerance: ±10%; Technology: SMT; Max Thickness: 1 mm; Value: 100nF; Rated Voltage: 16 V
DS3 = CMP-0404-00001-1: as DS1 on sheet MCU; Mounting Technology: Surface Mount; Storage Temperature: -40 to +85 degC; ComponentLink1URL: http://www.kingbright.com/; PackageDescription: 2-Pin SMT LED, 1.6 x 0.8 mm Pitch; PackageReference: 0603LED_GREEN; ComponentLink1Description: Manufacturer URL
FB2 = Res2: Resistor; Published: 8-Jun-2000; LatestRevisionDate: 17-Jul-2002; LatestRevisionNote: Re-released for DXP Platform.; PackageReference: AXIAL-0.4; Publisher: Altium Limited; PackageDescription: Axial Device, Thru-Hole; 2 Leads; 0.4 in Pin Spacing; Value: 120R@100MHz
L1 = Inductor: Code_IEC: 1005; Published: 8-Jun-2000; LatestRevisionDate: 29-May-2009; LatestRevisionNote: IPC-7351 Footprint Added.; PackageReference: 0402-A; Publisher: Altium Limited; PackageDescription: Chip Inductor; Code_JEITA: 0402; Value: 3.3uH
R18 = CMP-1012-00050-1: 100R 0.1W 5% 0603 (1608 Metric)  SMD; Case-EIA: 0603; Value: 100.00 Ohm; Case-Metric: 1608; Tolerance: 5 %; Technology: SMT; Power: 0.1 W
U3 = RT8008
U4 = CMP-0394-00568-1: Single Output LDO, 150 mA, Fixed 3.3 V Output, 2.7 to 10 V Input, with Low IQ, 5-pin SOT-23 (DBV), -40 to 125 degC, Green (RoHS & no Sb/Br); Manufacturer: Texas Instruments; Vout Adj(Max)(V): 3.3; Vin(Min)(V): 2.7; Vdo(Typ)(mV): 300; Accuracy(%): 3; Iq(Typ)(mA): 0.08; SubFamily: Single Channel LDO; Vin(Max)(V): 10; Iout(Max)(A): 0.15; DatasheetVersion: SLVS181H; ComponentLink1URL: http://www.ti.com/; Eco-Plan: Green (RoHS & no Sb/Br); PartNumber: TPS76333DBVRG4; PackageDescription: 5-Pin Plastic Small Outline, Body 1.60 Ã— 2.90 mm, Pitch 0.95 mm; ComponentLink1Description: Manufacturer URL; PackageVersion: 4073253-4/K; ComponentLink3URL: http://www.ti.com/litv/pdf/mpds018i; ComponentLink2URL: http://www.ti.com/general/docs/lit/getliterature.tsp?genericPartNumber=TPS76333&fileType=pdf; Fixed Output Options(V): 3.3; Vout Adj(Min)(V): 3.3; ComponentLink3Description: Package Specification; Mounting Technology: Surface Mount; Code_JEDEC: MO-178; ComponentLink2Description: Datasheet; PackageReference: DBV5

## Nets that join several sheets
+3V3: MCU (25 pins), Codec (C11.2 C12.2 U1.1 U1.27), Power (C23.2 C24.2 L1.2 U3.5)
+3V3A: MCU (5 pins), Codec (FB1.2), Power (C26.2 C27.2 U4.5)
+5V: MCU (F1.2), Power (7 pins)
AGND: MCU (5 pins), Codec (16 pins), Power (5 pins)
DGND: MCU (37 pins), Codec (7 pins), Power (6 pins)
TLV_BCLK: MCU (U2#1.78), Codec (U1.3)
TLV_DIN: MCU (U2#1.76), Codec (U1.4)
TLV_DOUT: MCU (U2#1.79), Codec (U1.6)
TLV_LRCIN: MCU (U2#1.77), Codec (U1.5)
TLV_LRCOUT: MCU (U2#1.80), Codec (U1.7)
TLV_SCLK: MCU (R6.1 U2#1.47), Codec (U1.24)
TLV_SDIN: MCU (R5.1 U2#1.46), Codec (U1.23)